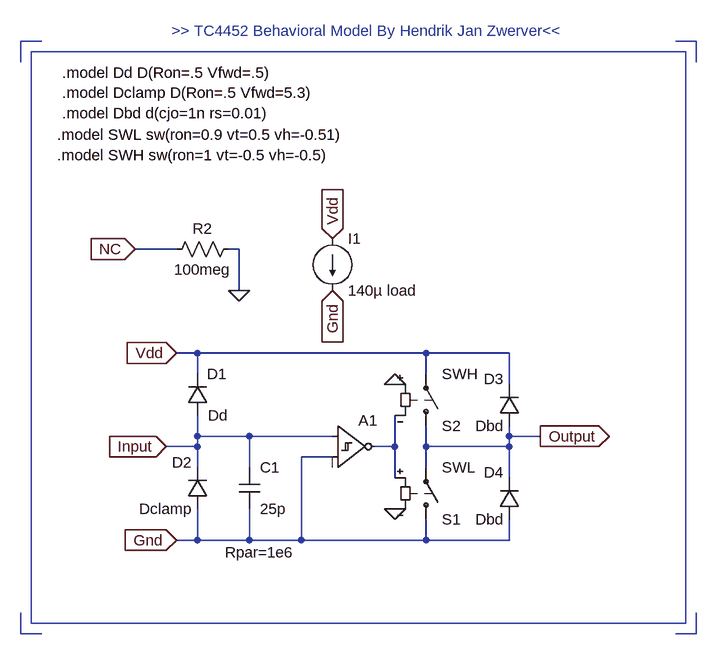
[diagram p0: schematic tc4452.asc]
tc4452.asc, the LTspice schematic file:
Version 4
SHEET 1 13828 1048
WIRE -464 -624 -496 -624
WIRE 544 -624 512 -624
WIRE -496 -592 -496 -624
WIRE 544 -592 544 -624
WIRE -256 -304 -320 -304
WIRE -160 -304 -176 -304
WIRE -160 -240 -160 -304
WIRE -224 -144 -256 -144
WIRE 128 -144 -224 -144
WIRE 256 -144 128 -144
WIRE -224 -112 -224 -144
WIRE 128 -112 128 -144
WIRE 256 -96 256 -144
WIRE -224 -16 -224 -48
WIRE -144 -16 -224 -16
WIRE -16 -16 -144 -16
WIRE 256 -16 256 -32
WIRE 304 -16 256 -16
WIRE -224 0 -224 -16
WIRE -224 0 -272 0
WIRE 80 0 80 -48
WIRE 80 0 48 0
WIRE 128 0 128 -32
WIRE 256 0 256 -16
WIRE 256 0 128 0
WIRE -16 16 -64 16
WIRE -224 32 -224 0
WIRE -144 32 -144 -16
WIRE 128 32 128 0
WIRE 80 48 80 0
WIRE 256 48 256 0
WIRE -224 144 -224 96
WIRE -224 144 -256 144
WIRE -144 144 -144 96
WIRE -144 144 -224 144
WIRE -64 144 -64 16
WIRE -64 144 -144 144
WIRE 128 144 128 112
WIRE 128 144 -64 144
WIRE 256 144 256 112
WIRE 256 144 128 144
WIRE -496 288 -496 256
WIRE -464 288 -496 288
WIRE 544 288 544 256
WIRE 544 288 512 288
FLAG -272 0 Input
IOPIN -272 0 In
FLAG -256 144 Gnd
IOPIN -256 144 In
FLAG 304 -16 Output
IOPIN 304 -16 Out
FLAG -256 -144 Vdd
IOPIN -256 -144 In
FLAG -320 -304 NC
IOPIN -320 -304 In
FLAG -160 -240 0
FLAG 80 96 0
FLAG 80 -96 0
FLAG -16 -240 Gnd
IOPIN -16 -240 In
FLAG -16 -320 Vdd
IOPIN -16 -320 In
SYMBOL diode -240 -48 M180
WINDOW 0 31 64 Left 0
WINDOW 3 32 0 Left 0
SYMATTR InstName D1
SYMATTR Value Dd
SYMBOL cap -160 32 R0
WINDOW 0 32 0 Left 0
WINDOW 3 32 64 Left 0
WINDOW 39 32 131 Center 0
SYMATTR InstName C1
SYMATTR Value 25p
SYMATTR SpiceLine Rpar=1e6
SYMBOL res -160 -320 R90
WINDOW 0 0 56 VBottom 0
WINDOW 3 32 56 VTop 0
SYMATTR InstName R2
SYMATTR Value 100meg
SYMBOL sw 128 128 M180
SYMATTR InstName S1
SYMATTR Value SWL
SYMBOL sw 128 -16 M180
SYMATTR InstName S2
SYMATTR Value SWH
SYMBOL diode 272 -32 R180
WINDOW 0 24 72 Left 0
WINDOW 3 24 0 Left 0
SYMATTR InstName D3
SYMATTR Value Dbd
SYMBOL diode 272 112 R180
WINDOW 0 24 72 Left 0
WINDOW 3 24 0 Left 0
SYMATTR InstName D4
SYMATTR Value Dbd
SYMBOL diode -208 96 R180
WINDOW 0 24 72 Left 0
WINDOW 3 24 0 Left 0
SYMATTR InstName D2
SYMATTR Value Dclamp
SYMBOL Digital\\diffschmtinv -16 -64 R0
SYMATTR InstName A1
SYMATTR SpiceLine vt={(2.4+0.8)/2} vh={(2.4-0.8)/2}
SYMATTR Value2 trise=55n tripdt=20n
SYMBOL current -16 -320 R0
WINDOW 123 0 0 Left 0
WINDOW 39 0 0 Left 0
SYMATTR InstName I1
SYMATTR Value 140µ load
TEXT 40 -640 Center 0 ;>> TC4452 Behavioral Model By Hendrik Jan Zwerver<<
TEXT -432 -576 Left 0 !.model Dd D(Ron=.5 Vfwd=.5)\n.model Dclamp D(Ron=.5 Vfwd=5.3)\n.model Dbd d(cjo=1n rs=0.01)
TEXT -440 -480 Left 0 !.model SWL sw(ron=0.9 vt=0.5 vh=-0.51)\n.model SWH sw(ron=1 vt=-0.5 vh=-0.5)
RECTANGLE Normal 528 272 -480 -608

The netlist it stands for:
* tc4452.asc
D1 Input Vdd Dd
C1 Input Gnd 25p Rpar=1e6
R2 0 NC 100meg
S1 Gnd Output N003 0 SWL
S2 Output Vdd 0 N003 SWH
D3 Output Vdd Dbd
D4 Gnd Output Dbd
D2 Gnd Input Dclamp
A1 Input Gnd 0 0 0 N003 0 0 SCHMITT trise=55n tripdt=20n vt={(2.4+0.8)/2} vh={(2.4-0.8)/2}
I1 Vdd Gnd 140µ load
.model D D
.lib standard.dio
* >> TC4452 Behavioral Model By Hendrik Jan Zwerver<<
.model Dd D(Ron=.5 Vfwd=.5)
.model Dclamp D(Ron=.5 Vfwd=5.3)
.model Dbd d(cjo=1n rs=0.01)
.model SWL sw(ron=0.9 vt=0.5 vh=-0.51)
.model SWH sw(ron=1 vt=-0.5 vh=-0.5)
.backanno
.end